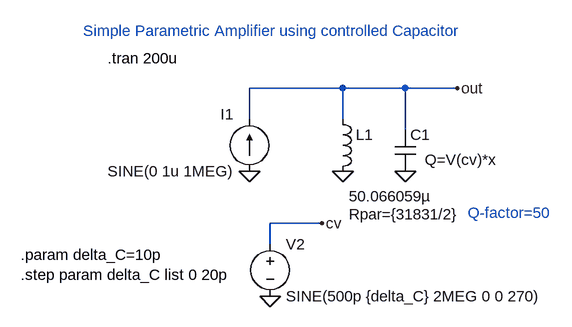
[diagram p0: schematic Parametric_Amplifier1.asc]
Parametric_Amplifier1.asc, the LTspice schematic file:
Version 4
SHEET 1 880 680
WIRE -48 176 -48 128
WIRE -16 368 -16 336
WIRE 64 336 -16 336
WIRE 96 128 -48 128
WIRE 96 176 96 128
WIRE 192 128 96 128
WIRE 192 192 192 128
WIRE 272 128 192 128
FLAG 192 256 0
FLAG -16 448 0
FLAG 64 336 cv
FLAG 96 256 0
FLAG -48 256 0
FLAG 272 128 out
SYMBOL cap 176 192 R0
WINDOW 3 46 46 Left 0
SYMATTR Value Q=V(cv)*x
SYMATTR InstName C1
SYMBOL voltage -16 352 R0
WINDOW 123 0 0 Left 0
WINDOW 39 0 0 Left 0
SYMATTR InstName V2
SYMATTR Value SINE(500p {delta_C} 2MEG 0 0 270)
SYMBOL ind 80 160 R0
WINDOW 3 25 134 Left 0
WINDOW 39 25 162 Left 0
SYMATTR InstName L1
SYMATTR Value 50.066059µ
SYMATTR SpiceLine Rpar={31831/2}
SYMBOL current -48 256 R180
WINDOW 0 24 88 Left 0
WINDOW 3 24 0 Left 0
WINDOW 123 0 0 Left 0
WINDOW 39 0 0 Left 0
SYMATTR InstName I1
SYMATTR Value SINE(0 1u 1MEG)
TEXT -266 82 Left 0 !.tran 200u
TEXT -400 384 Left 0 !.param delta_C=10p\n.step param delta_C list 0 20p
TEXT 288 320 Left 0 ;Q-factor=50
TEXT -304 40 Left 0 ;Simple Parametric Amplifier using controlled Capacitor

The netlist it stands for:
* Parametric_Amplifier1.asc
C1 out 0 Q=V(cv)*x
V2 cv 0 SINE(500p {delta_C} 2MEG 0 0 270)
L1 out 0 50.066059µ Rpar={31831/2}
I1 0 out SINE(0 1u 1MEG)
.tran 200u
.param delta_C=10p
.step param delta_C list 0 20p
* Q-factor=50
* Simple Parametric Amplifier using controlled Capacitor
.backanno
.end